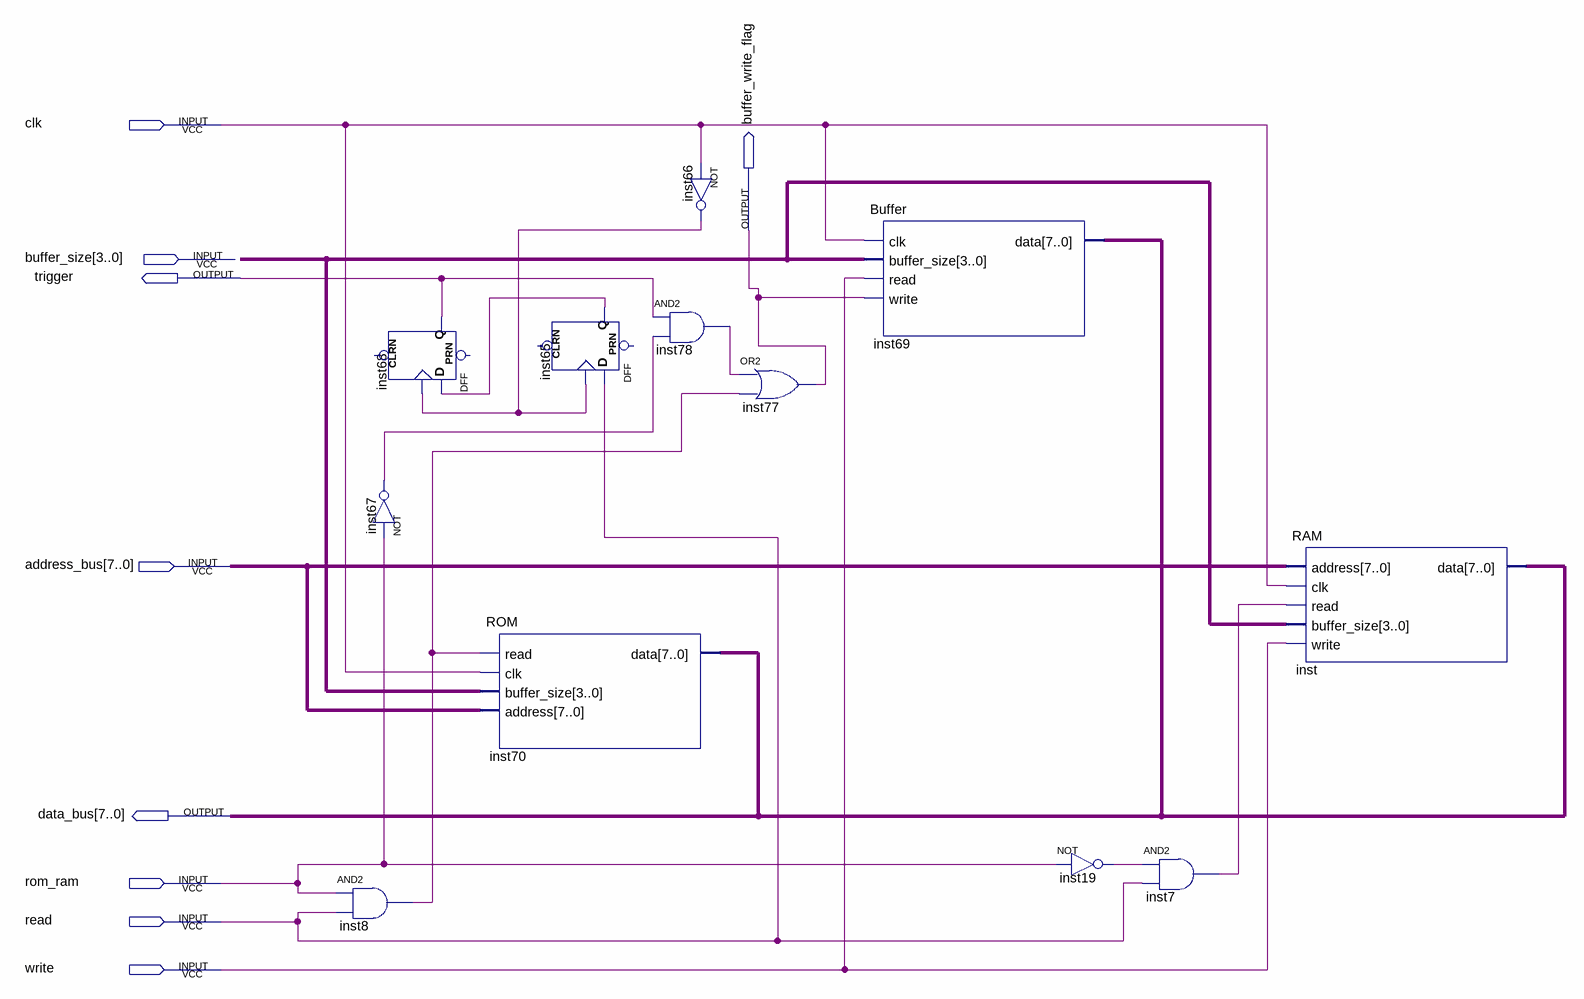
[diagram p0: schematic sheet]
// Quartus schematic Memory.bdf as structural Verilog: 12 symbols, 9 pins
module Memory (
  input  clk,
  input  [3:0] buffer_size,
  input  [7:0] address_bus,
  input  rom_ram,
  input  read,
  input  write,
  output buffer_write_flag,
  output trigger,
  output [7:0] data_bus
);

  wire inst7_out, inst8_out, inst19_out, inst65_q, inst66_out, inst67_out, inst78_out;

  DFF inst68 (.CLK(inst66_out), .D(inst65_q), .Q(trigger));  // open: CLRN, PRN
  not inst67 (inst67_out, rom_ram);
  and inst8 (inst8_out, rom_ram, read);
  DFF inst65 (.CLK(inst66_out), .D(read), .Q(inst65_q));  // open: CLRN, PRN
  ROM inst70 (.read(inst8_out), .clk(clk), .buffer_size(buffer_size), .address(address_bus), .data(data_bus));
  not inst66 (inst66_out, clk);
  and inst78 (inst78_out, trigger, inst67_out);
  or inst77 (buffer_write_flag, inst78_out, inst8_out);
  Buffer inst69 (.clk(clk), .buffer_size(buffer_size), .read(write), .write(buffer_write_flag), .data(data_bus));
  not inst19 (inst19_out, rom_ram);
  and inst7 (inst7_out, inst19_out, read);
  RAM inst (
    .address(address_bus), .clk(clk), .read(inst7_out), .buffer_size(buffer_size), .write(write),
    .data(data_bus));
endmodule
